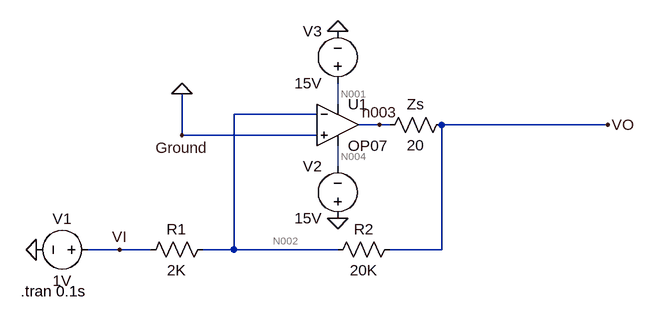
[diagram p0: schematic Draft1.asc]
Draft1.asc, the LTspice schematic file:
Version 4
SHEET 1 1652 680
WIRE 1184 80 1184 48
WIRE 1152 96 1024 96
WIRE 1248 112 1216 112
WIRE 1264 112 1248 112
WIRE 1600 112 1344 112
WIRE 944 128 944 64
WIRE 1152 128 944 128
WIRE 1184 176 1184 144
WIRE 848 304 800 304
WIRE 896 304 848 304
WIRE 1024 304 1024 96
WIRE 1024 304 976 304
WIRE 1184 304 1024 304
WIRE 1344 304 1344 112
WIRE 1344 304 1264 304
FLAG 944 64 0
FLAG 720 304 0
FLAG 848 304 VI
FLAG 1600 112 VO
FLAG 1184 256 0
FLAG 1184 -32 0
FLAG 944 128 Ground
FLAG 1248 112 n003
SYMBOL OpAmps\\OP07 1184 48 R0
SYMATTR InstName U1
SYMBOL res 1280 288 R90
WINDOW 0 0 56 VBottom 2
WINDOW 3 32 56 VTop 2
SYMATTR InstName R2
SYMATTR Value 20K
SYMBOL res 992 288 R90
WINDOW 0 0 56 VBottom 2
WINDOW 3 32 56 VTop 2
SYMATTR InstName R1
SYMATTR Value 2K
SYMBOL voltage 816 304 R90
WINDOW 0 -32 56 VBottom 2
WINDOW 3 32 56 VTop 2
WINDOW 123 0 0 Left 0
WINDOW 39 0 0 Left 0
SYMATTR InstName V1
SYMATTR Value 1V
SYMBOL voltage 1184 272 R180
WINDOW 0 24 96 Left 2
WINDOW 3 24 16 Left 2
SYMATTR InstName V2
SYMATTR Value 15V
SYMBOL voltage 1184 64 R180
WINDOW 0 24 96 Left 2
WINDOW 3 24 16 Left 2
WINDOW 123 0 0 Left 0
WINDOW 39 0 0 Left 0
SYMATTR InstName V3
SYMATTR Value 15V
SYMBOL res 1360 96 R90
WINDOW 0 0 56 VBottom 2
WINDOW 3 32 56 VTop 2
SYMATTR InstName Zs
SYMATTR Value 20
TEXT 696 368 Left 2 !.tran 0.1s

The netlist it stands for:
* Draft1.asc
XU1 0 N002 N001 N004 n003 LT1001  ; OP07, pins In+ In- V+ V- OUT
R2 VO N002 20K
R1 N002 VI 2K
V1 VI 0 1V
V2 0 N004 15V
V3 N001 0 15V
R§Zs VO n003 20
.tran 0.1s
.lib LTC.lib
.backanno
.end

* Results of the author's LTspice run, read from the files saved beside the schematic
* Operating Point, zero values left out:
*   V(n002) = 13.43 µV
*   V(n001) = 15 V
*   V(n004) = -15 V
*   V(n003) = -10.01 V
*   V(vo) = -10 V
*   V(vi) = 1 V
*   I(Zs) = 500 µA
*   I(R1) = -500 µA
*   I(R2) = -500 µA
*   I(V3) = -2.007 mA
*   I(V2) = -2.507 mA
*   I(V1) = -500 µA
*   Ix(u1:3) = 2.007 mA
*   Ix(u1:4) = -2.507 mA
*   Ix(u1:5) = 500 µA